# Altium schematic sheet [8]_Peripherals.SchDoc
size A3; DocumentNumber: 8; SheetNumber: 8; SheetTotal: 9; PageSetup: Record=PageOptions|CenterHorizontal=True|CenterVertical=True|PrintScale=0.97|XCorrection=1.00|YCorrection=1.00|PrintKind=1|BorderSize=5000000|LeftOffset=0|BottomOffset=0|Orientation=2|PaperLength=2970|PaperWidth=2100|Scale=100|PaperSource=7|PrintQuality=600|MediaType=1|DitherType=10|PaperKind=A4|PrintScaleMode=1
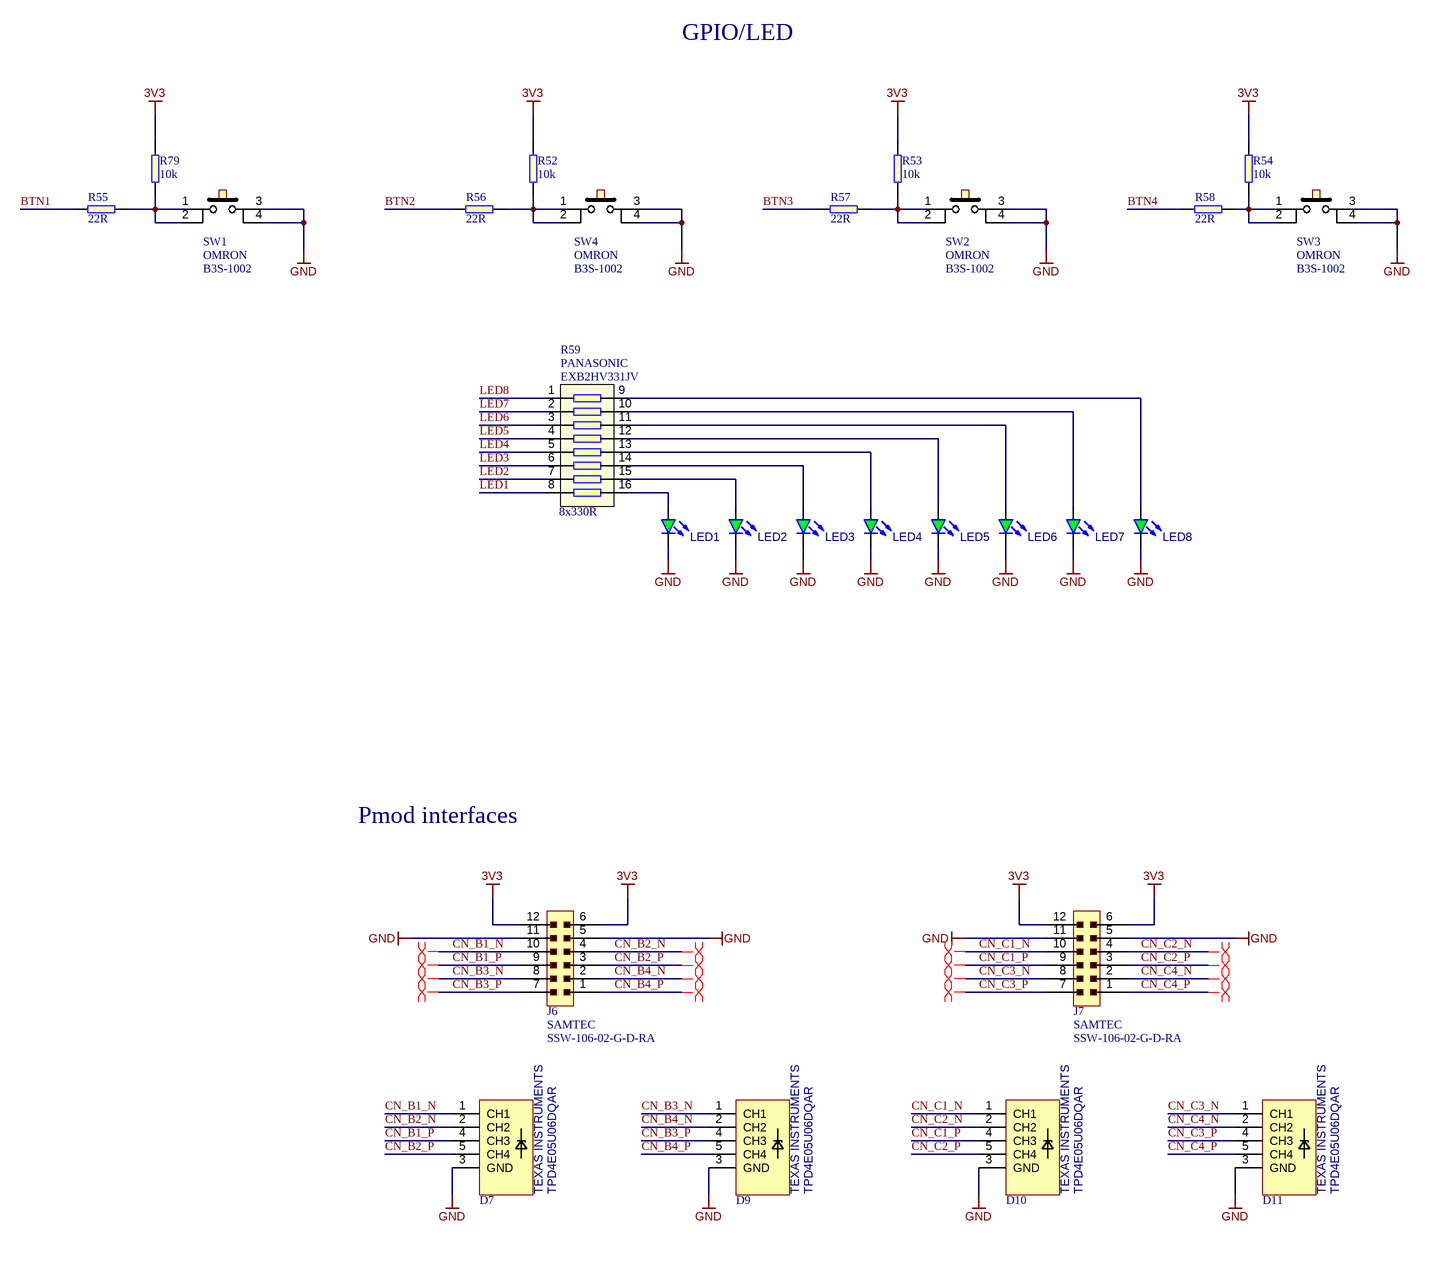
[diagram p0: [8]_Peripherals.SchDoc]

## Parts
D7  Manufacturer: TEXAS INSTRUMENTS  Part Symbol: TPD4E05U06DQAR  [TPD4E05U06_PASS]  (hidden comment: TPD4E05U06)
D9  Manufacturer: TEXAS INSTRUMENTS  Part Symbol: TPD4E05U06DQAR  [TPD4E05U06_PASS]  (hidden comment: TPD4E05U06)
D10  Manufacturer: TEXAS INSTRUMENTS  Part Symbol: TPD4E05U06DQAR  [TPD4E05U06_PASS]  (hidden comment: TPD4E05U06)
D11  Manufacturer: TEXAS INSTRUMENTS  Part Symbol: TPD4E05U06DQAR  [TPD4E05U06_PASS]  (hidden comment: TPD4E05U06)
J6  Manufacturer: SAMTEC  [SSW-106-02-G-D-RA]  (hidden comment: SSW-106-02-G-D-RA)
J7  Manufacturer: SAMTEC  [SSW-106-02-G-D-RA]  (hidden comment: SSW-106-02-G-D-RA)
LED1  KPT-1608SGC  [LED0603]  (value not drawn)
LED2  KPT-1608SGC  [LED0603]  (value not drawn)
LED3  KPT-1608SGC  [LED0603]  (value not drawn)
LED4  KPT-1608SGC  [LED0603]  (value not drawn)
LED5  KPT-1608SGC  [LED0603]  (value not drawn)
LED6  KPT-1608SGC  [LED0603]  (value not drawn)
LED7  KPT-1608SGC  [LED0603]  (value not drawn)
LED8  KPT-1608SGC  [LED0603]  (value not drawn)
R52  10k  [0402]
R53  10k  [0402]
R54  10k  [0402]
R55  22R  [0402]
R56  22R  [0402]
R57  22R  [0402]
R58  22R  [0402]
R59  8x330R  Manufacturer: PANASONIC  Part Symbol: EXB2HV331JV  [R_ARRAY_0402]
R79  10k  [0402]
SW1  Manufacturer: OMRON  [B3S-100X]  (hidden comment: B3S-1002)
SW2  Manufacturer: OMRON  [B3S-100X]  (hidden comment: B3S-1002)
SW3  Manufacturer: OMRON  Part Symbol: B3S-1002  [B3S-100X]  (hidden comment: B3S-100X)
SW4  Manufacturer: OMRON  Part Symbol: B3S-1002  [B3S-100X]  (hidden comment: B3S-100X)

## Nets
3V3: J6.6 J6.12 J7.6 J7.12 R52.2 R53.2 R54.2 R79.2
GND: D7.3(GND) D9.3(GND) D10.3(GND) D11.3(GND) J6.5 J6.11 J7.5 J7.11 LED1.K LED2.K LED3.K LED4.K LED5.K LED6.K LED7.K LED8.K SW1.3 SW1.4 SW2.3 SW2.4 SW3.3 SW3.4 SW4.3 SW4.4
BTN1: R55.1
BTN2: R56.1
BTN3: R57.1
BTN4: R58.1
CN_B1_N: D7.1(CH1) J6.10
CN_B1_P: D7.4(CH3) J6.9
CN_B2_N: D7.2(CH2) J6.4
CN_B2_P: D7.5(CH4) J6.3
CN_B3_N: D9.1(CH1) J6.8
CN_B3_P: D9.4(CH3) J6.7
CN_B4_N: D9.2(CH2) J6.2
CN_B4_P: D9.5(CH4) J6.1
CN_C1_N: D10.1(CH1) J7.10
CN_C1_P: D10.4(CH3) J7.9
CN_C2_N: D10.2(CH2) J7.4
CN_C2_P: D10.5(CH4) J7.3
CN_C3_N: D11.1(CH1) J7.8
CN_C3_P: D11.4(CH3) J7.7
CN_C4_N: D11.2(CH2) J7.2
CN_C4_P: D11.5(CH4) J7.1
LED1: R59.8
LED2: R59.7
LED3: R59.6
LED4: R59.5
LED5: R59.4
LED6: R59.3
LED7: R59.2
LED8: R59.1
NetLED1_A: LED1.A R59.16
NetLED2_A: LED2.A R59.15
NetLED3_A: LED3.A R59.14
NetLED4_A: LED4.A R59.13
NetLED5_A: LED5.A R59.12
NetLED6_A: LED6.A R59.11
NetLED7_A: LED7.A R59.10
NetLED8_A: LED8.A R59.9
NetR52_1: R52.1 R56.2 SW4.1 SW4.2
NetR53_1: R53.1 R57.2 SW2.1 SW2.2
NetR54_1: R54.1 R58.2 SW3.1 SW3.2
NetR55_2: R55.2 R79.1 SW1.1 SW1.2

## Layout directives
differential pair: CN_B1_N, CN_B1_P, CN_B2_N, CN_B2_P, CN_B3_N, CN_B3_P, CN_B4_N, CN_B4_P, CN_C1_N, CN_C1_P, CN_C2_N, CN_C2_P, CN_C3_N, CN_C3_P, CN_C4_N, CN_C4_P

## Notes on the sheet
- GPIO/LED
- Pmod interfaces
- Title:
- Size:
- Date:
- A3
- Revision:
- Page:
- of
- Antmicro Ltd.
- File:
- www.antmicro.com

## Library data of the parts
D7 D9-D11 = TPD4E05U06: ESD Suppressors 4-CH; Part Number: TPD4E05U06_PASS; Value: TPD4E05U06
J6 J7 = SSW-106-02-G-D-RA: Board-To-Board Connector, Right Angle, 2.54 mm, 12 Contacts, Receptacle, SSW Series, Through Hole; Part Number: SSW-106-02-G-D-RA; Value: SSW-106-02-G-D-RA; Part Symbol: SSW-106-02-G-D-RA
LED1-LED8 = LED: LED Green 0603 case; Part Number: LED_G; Manufacturer: KINGBRIGHT; Value: KPT-1608SGC; Part Symbol: KPT-1608SGC
R52-R54 R79 = R_10k_0402: SMT Resistor 10k 0402; Manufacturer: MULTICOMP; Part Symbol: MCMR04X1002FTL; Tolerance: 1%; Part Number: R_10k_0402; Value: 10k
R55-R58 = R_22R_0402: SMT Resistor 22R 0402; Manufacturer: VISHAY; Part Symbol: CRCW040222R0FKED; Tolerance: 1%; Part Number: R_22R_0402; Value: 22R
R59 = R_ARRAY: SMD Resistors Array 0402; Part Number: Resistor Array_8x330R_0402; Tolerance: 5%; Value: 8x330R
SW1-SW4 = TACTILE_SWITCH: Tactile switch; Part Number: B3S-1002
  SW1 SW2: Value: B3S-1002; Part Symbol: B3S-1002
  SW3 SW4: Value: B3S-100X